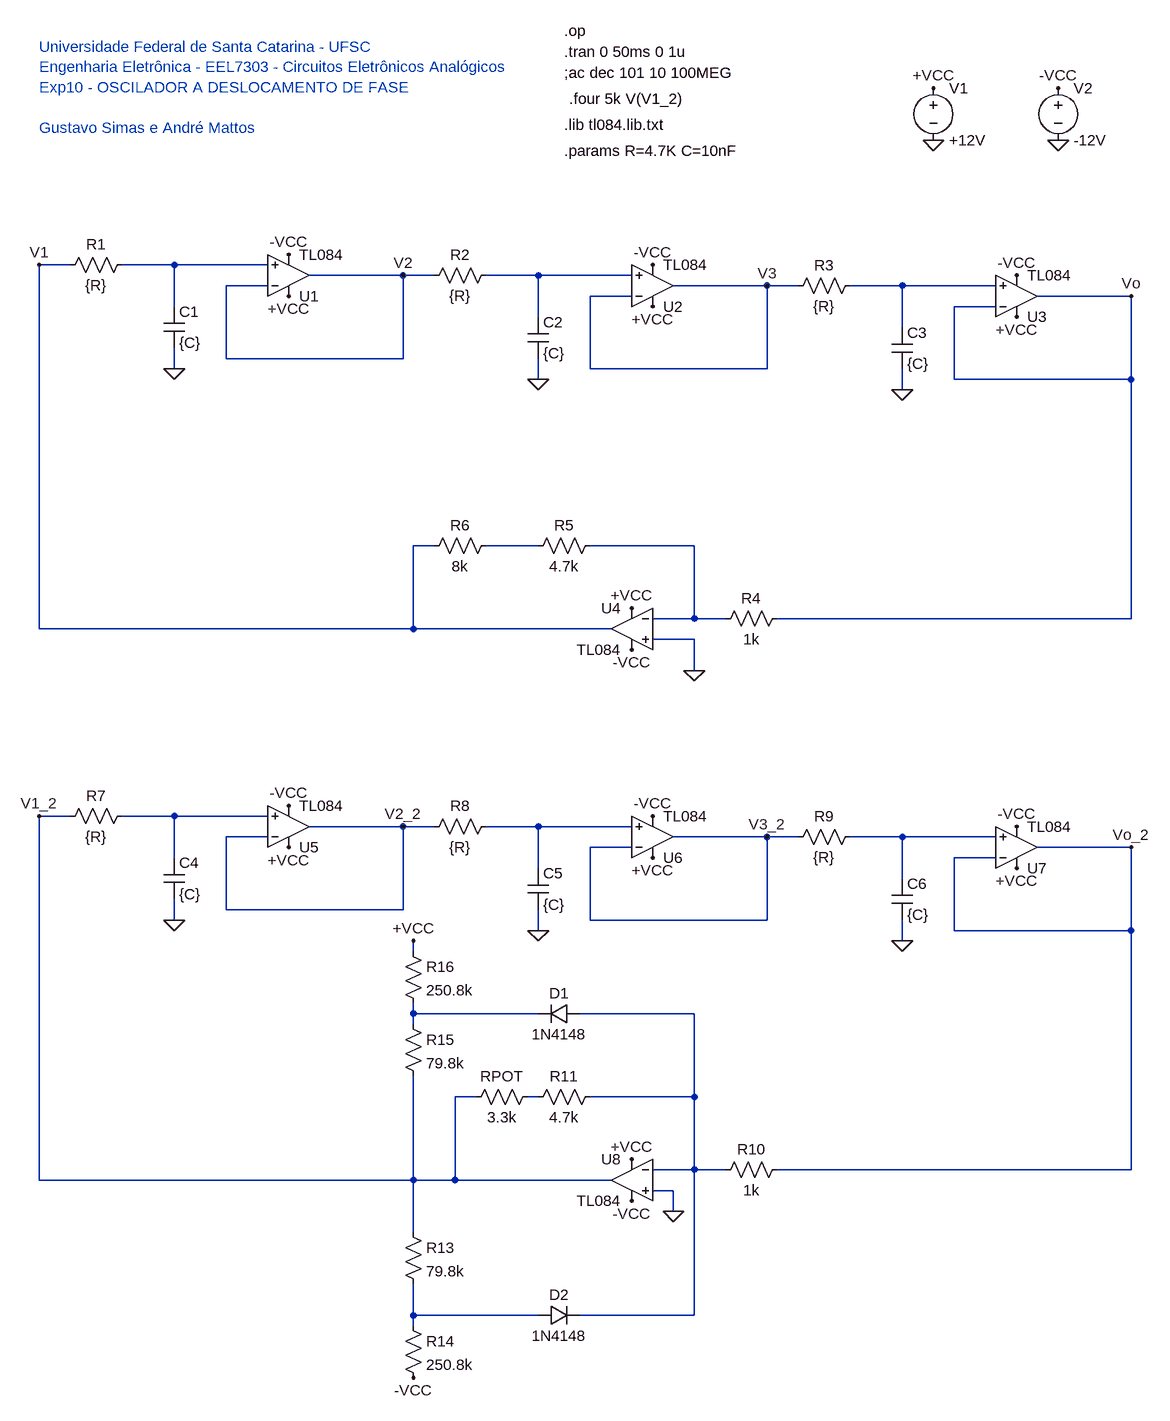
[diagram p0: schematic Lab10.asc]
Lab10.asc, the LTspice schematic file:
Version 4
SHEET 1 2264 2292
WIRE -16 384 -64 384
WIRE 144 384 64 384
WIRE 288 384 144 384
WIRE 496 400 352 400
WIRE 544 400 496 400
WIRE 704 400 624 400
WIRE 848 400 704 400
WIRE 288 416 224 416
WIRE 1056 416 912 416
WIRE 1104 416 1056 416
WIRE 1264 416 1184 416
WIRE 1408 416 1264 416
WIRE 848 432 784 432
WIRE 1616 432 1472 432
WIRE 144 448 144 384
WIRE 1408 448 1344 448
WIRE 704 464 704 400
WIRE 1264 480 1264 416
WIRE 224 528 224 416
WIRE 496 528 496 400
WIRE 496 528 224 528
WIRE 144 544 144 512
WIRE 784 544 784 432
WIRE 1056 544 1056 416
WIRE 1056 544 784 544
WIRE 704 560 704 528
WIRE 1344 560 1344 448
WIRE 1616 560 1616 432
WIRE 1616 560 1344 560
WIRE 1264 576 1264 544
WIRE 544 816 512 816
WIRE 704 816 624 816
WIRE 944 816 784 816
WIRE 944 928 944 816
WIRE 944 928 880 928
WIRE 992 928 944 928
WIRE 1616 928 1616 560
WIRE 1616 928 1072 928
WIRE -64 944 -64 384
WIRE 512 944 512 816
WIRE 512 944 -64 944
WIRE 816 944 512 944
WIRE 944 960 880 960
WIRE 944 1008 944 960
WIRE -16 1232 -64 1232
WIRE 144 1232 64 1232
WIRE 288 1232 144 1232
WIRE 496 1248 352 1248
WIRE 544 1248 496 1248
WIRE 704 1248 624 1248
WIRE 848 1248 704 1248
WIRE 288 1264 224 1264
WIRE 1056 1264 912 1264
WIRE 1104 1264 1056 1264
WIRE 1264 1264 1184 1264
WIRE 1408 1264 1264 1264
WIRE 848 1280 784 1280
WIRE 1616 1280 1472 1280
WIRE 144 1296 144 1232
WIRE 1408 1296 1344 1296
WIRE 704 1312 704 1248
WIRE 1264 1328 1264 1264
WIRE 224 1376 224 1264
WIRE 496 1376 496 1248
WIRE 496 1376 224 1376
WIRE 144 1392 144 1360
WIRE 784 1392 784 1280
WIRE 1056 1392 1056 1264
WIRE 1056 1392 784 1392
WIRE 704 1408 704 1376
WIRE 1344 1408 1344 1296
WIRE 1616 1408 1616 1280
WIRE 1616 1408 1344 1408
WIRE 1264 1424 1264 1392
WIRE 512 1440 512 1424
WIRE 512 1536 512 1520
WIRE 704 1536 512 1536
WIRE 944 1536 768 1536
WIRE 512 1552 512 1536
WIRE 608 1664 576 1664
WIRE 704 1664 688 1664
WIRE 944 1664 944 1536
WIRE 944 1664 784 1664
WIRE 944 1776 944 1664
WIRE 944 1776 880 1776
WIRE 992 1776 944 1776
WIRE 1616 1776 1616 1408
WIRE 1616 1776 1072 1776
WIRE -64 1792 -64 1232
WIRE 512 1792 512 1632
WIRE 512 1792 -64 1792
WIRE 576 1792 576 1664
WIRE 576 1792 512 1792
WIRE 816 1792 576 1792
WIRE 912 1808 880 1808
WIRE 912 1840 912 1808
WIRE 512 1872 512 1792
WIRE 512 2000 512 1952
WIRE 704 2000 512 2000
WIRE 944 2000 944 1776
WIRE 944 2000 768 2000
WIRE 512 2016 512 2000
FLAG 144 544 0
FLAG 1312 192 0
FLAG 1504 192 0
FLAG 1312 112 +VCC
FLAG 320 432 +VCC
FLAG 1504 112 -VCC
FLAG 320 368 -VCC
FLAG 704 560 0
FLAG 880 448 +VCC
FLAG 880 384 -VCC
FLAG 1264 576 0
FLAG 1440 464 +VCC
FLAG 1440 400 -VCC
FLAG 848 912 +VCC
FLAG 848 976 -VCC
FLAG 944 1008 0
FLAG 1616 432 Vo
FLAG -64 384 V1
FLAG 496 400 V2
FLAG 1056 416 V3
FLAG 144 1392 0
FLAG 320 1280 +VCC
FLAG 320 1216 -VCC
FLAG 704 1408 0
FLAG 880 1296 +VCC
FLAG 880 1232 -VCC
FLAG 1264 1424 0
FLAG 1440 1312 +VCC
FLAG 1440 1248 -VCC
FLAG 848 1760 +VCC
FLAG 848 1824 -VCC
FLAG 1616 1280 Vo_2
FLAG -64 1232 V1_2
FLAG 496 1248 V2_2
FLAG 1056 1264 V3_2
FLAG 512 2096 -VCC
FLAG 512 1424 +VCC
FLAG 912 1840 0
SYMBOL Opamps\\opamp2 320 464 M180
SYMATTR InstName U1
SYMATTR Value TL084
SYMBOL res 80 368 R90
WINDOW 0 0 56 VBottom 2
WINDOW 3 32 56 VTop 2
SYMATTR InstName R1
SYMATTR Value {R}
SYMBOL cap 128 448 R0
SYMATTR InstName C1
SYMATTR Value {C}
SYMBOL voltage 1312 96 R0
WINDOW 123 0 0 Left 0
WINDOW 39 0 0 Left 0
SYMATTR InstName V1
SYMATTR Value +12V
SYMBOL voltage 1504 96 R0
WINDOW 123 0 0 Left 0
WINDOW 39 0 0 Left 0
SYMATTR InstName V2
SYMATTR Value -12V
SYMBOL Opamps\\opamp2 880 480 M180
SYMATTR InstName U2
SYMATTR Value TL084
SYMBOL res 640 384 R90
WINDOW 0 0 56 VBottom 2
WINDOW 3 32 56 VTop 2
SYMATTR InstName R2
SYMATTR Value {R}
SYMBOL cap 688 464 R0
SYMATTR InstName C2
SYMATTR Value {C}
SYMBOL Opamps\\opamp2 1440 496 M180
SYMATTR InstName U3
SYMATTR Value TL084
SYMBOL res 1200 400 R90
WINDOW 0 0 56 VBottom 2
WINDOW 3 32 56 VTop 2
SYMATTR InstName R3
SYMATTR Value {R}
SYMBOL cap 1248 480 R0
SYMATTR InstName C3
SYMATTR Value {C}
SYMBOL res 1088 912 R90
WINDOW 0 0 56 VBottom 2
WINDOW 3 32 56 VTop 2
SYMATTR InstName R4
SYMATTR Value 1k
SYMBOL res 800 800 R90
WINDOW 0 0 56 VBottom 2
WINDOW 3 32 56 VTop 2
SYMATTR InstName R5
SYMATTR Value 4.7k
SYMBOL res 640 800 R90
WINDOW 0 0 56 VBottom 2
WINDOW 3 32 56 VTop 2
SYMATTR InstName R6
SYMATTR Value 8k
SYMBOL Opamps\\opamp2 848 880 M0
SYMATTR InstName U4
SYMATTR Value TL084
SYMBOL diode 768 1520 R90
WINDOW 0 0 32 VBottom 2
WINDOW 3 32 32 VTop 2
SYMATTR InstName D1
SYMATTR Value 1N4148
SYMBOL Opamps\\opamp2 320 1312 M180
SYMATTR InstName U5
SYMATTR Value TL084
SYMBOL res 80 1216 R90
WINDOW 0 0 56 VBottom 2
WINDOW 3 32 56 VTop 2
SYMATTR InstName R7
SYMATTR Value {R}
SYMBOL cap 128 1296 R0
SYMATTR InstName C4
SYMATTR Value {C}
SYMBOL Opamps\\opamp2 880 1328 M180
SYMATTR InstName U6
SYMATTR Value TL084
SYMBOL res 640 1232 R90
WINDOW 0 0 56 VBottom 2
WINDOW 3 32 56 VTop 2
SYMATTR InstName R8
SYMATTR Value {R}
SYMBOL cap 688 1312 R0
SYMATTR InstName C5
SYMATTR Value {C}
SYMBOL Opamps\\opamp2 1440 1344 M180
SYMATTR InstName U7
SYMATTR Value TL084
SYMBOL res 1200 1248 R90
WINDOW 0 0 56 VBottom 2
WINDOW 3 32 56 VTop 2
SYMATTR InstName R9
SYMATTR Value {R}
SYMBOL cap 1248 1328 R0
SYMATTR InstName C6
SYMATTR Value {C}
SYMBOL res 1088 1760 R90
WINDOW 0 0 56 VBottom 2
WINDOW 3 32 56 VTop 2
SYMATTR InstName R10
SYMATTR Value 1k
SYMBOL res 800 1648 R90
WINDOW 0 0 56 VBottom 2
WINDOW 3 32 56 VTop 2
SYMATTR InstName R11
SYMATTR Value 4.7k
SYMBOL res 704 1648 R90
WINDOW 0 0 56 VBottom 2
WINDOW 3 32 56 VTop 2
SYMATTR InstName RPOT
SYMATTR Value 3.3k
SYMBOL Opamps\\opamp2 848 1728 M0
SYMATTR InstName U8
SYMATTR Value TL084
SYMBOL res 496 1856 R0
SYMATTR InstName R13
SYMATTR Value 79.8k
SYMBOL res 496 2000 R0
SYMATTR InstName R14
SYMATTR Value 250.8k
SYMBOL res 496 1536 R0
SYMATTR InstName R15
SYMATTR Value 79.8k
SYMBOL res 496 1424 R0
SYMATTR InstName R16
SYMATTR Value 250.8k
SYMBOL diode 704 2016 R270
WINDOW 0 32 32 VTop 2
WINDOW 3 0 32 VBottom 2
SYMATTR InstName D2
SYMATTR Value 1N4148
TEXT 744 168 Left 2 !.lib tl084.lib.txt
TEXT 744 208 Left 2 !.params R=4.7K C=10nF
TEXT 744 56 Left 2 !.tran 0 50ms 0 1u
TEXT 744 24 Left 2 !.op
TEXT 744 88 Left 2 !;ac dec 101 10 100MEG
TEXT -64 48 Left 2 ;Universidade Federal de Santa Catarina - UFSC\nEngenharia Eletrônica - EEL7303 - Circuitos Eletrônicos Analógicos\nExp10 - OSCILADOR A DESLOCAMENTO DE FASE \n\nGustavo Simas e André Mattos
TEXT 752 128 Left 2 !.four 5k V(V1_2)

The netlist it stands for:
* Lab10.asc
XU1 N001 V2 +VCC -VCC V2 TL084  ; pins In+ In- V+ V- OUT
R1 N001 V1 {R}
C1 N001 0 {C}
V1 +VCC 0 +12V
V2 -VCC 0 -12V
XU2 N002 V3 +VCC -VCC V3 TL084  ; pins In+ In- V+ V- OUT
R2 N002 V2 {R}
C2 N002 0 {C}
XU3 N003 Vo +VCC -VCC Vo TL084  ; pins In+ In- V+ V- OUT
R3 N003 V3 {R}
C3 N003 0 {C}
R4 Vo N005 1k
R5 N005 N004 4.7k
R6 N004 V1 8k
XU4 0 N005 +VCC -VCC V1 TL084  ; pins In+ In- V+ V- OUT
D1 N010 N009 1N4148
XU5 N006 V2_2 +VCC -VCC V2_2 TL084  ; pins In+ In- V+ V- OUT
R7 N006 V1_2 {R}
C4 N006 0 {C}
XU6 N007 V3_2 +VCC -VCC V3_2 TL084  ; pins In+ In- V+ V- OUT
R8 N007 V2_2 {R}
C5 N007 0 {C}
XU7 N008 Vo_2 +VCC -VCC Vo_2 TL084  ; pins In+ In- V+ V- OUT
R9 N008 V3_2 {R}
C6 N008 0 {C}
R10 Vo_2 N010 1k
R11 N010 N011 4.7k
RPOT N011 V1_2 3.3k
XU8 0 N010 +VCC -VCC V1_2 TL084  ; pins In+ In- V+ V- OUT
R13 V1_2 N012 79.8k
R14 N012 -VCC 250.8k
R15 N009 V1_2 79.8k
R16 +VCC N009 250.8k
D2 N012 N010 1N4148
.model D D
.lib standard.dio
.lib tl084.lib.txt
.params R=4.7K C=10nF
.tran 0 50ms 0 1u
.op
;ac dec 101 10 100MEG
* Universidade Federal de Santa Catarina - UFSC
* Engenharia Eletrônica - EEL7303 - Circuitos Eletrônicos Analógicos
* Exp10 - OSCILADOR A DESLOCAMENTO DE FASE
* Gustavo Simas e André Mattos
.four 5k V(V1_2)
.backanno
.end